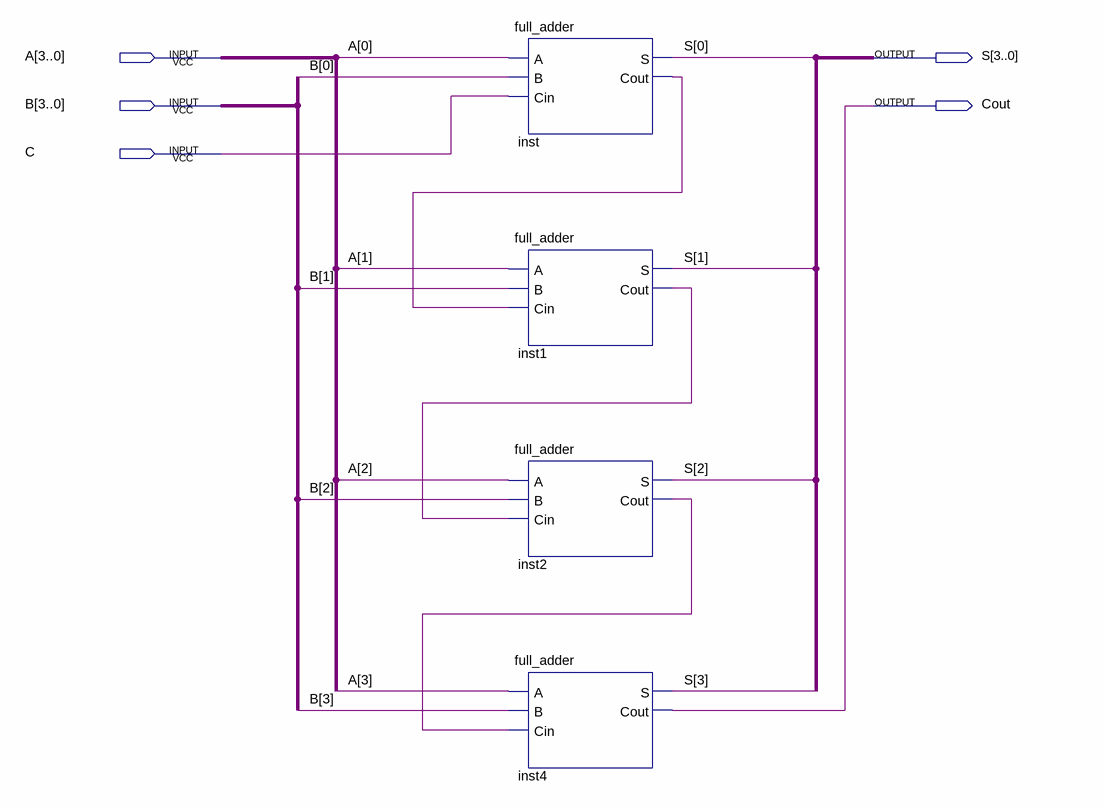
[diagram p0: schematic sheet]
// Quartus schematic full_adder_4b.bdf as structural Verilog: 4 symbols, 5 pins
module full_adder_4b (
  input  [3:0] A,
  input  [3:0] B,
  input  C,
  output [3:0] S,
  output Cout
);

  wire inst1_cout, inst2_cout, inst_cout;

  full_adder inst (.A(A[0]), .B(B[0]), .Cin(C), .S(S[0]), .Cout(inst_cout));
  full_adder inst1 (.A(A[1]), .B(B[1]), .Cin(inst_cout), .S(S[1]), .Cout(inst1_cout));
  full_adder inst2 (.A(A[2]), .B(B[2]), .Cin(inst1_cout), .S(S[2]), .Cout(inst2_cout));
  full_adder inst4 (.A(A[3]), .B(B[3]), .Cin(inst2_cout), .S(S[3]), .Cout(Cout));
endmodule
